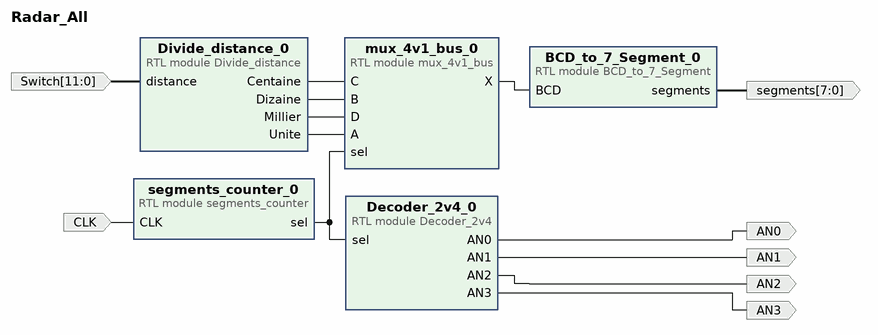
[diagram p0: block diagram of the top level]
# Vivado block design Radar_All, xc7a35ticpg236-1L, Vivado 2022.2
create_bd_design Radar_All

create_bd_port -dir I -from 11 -to 0 Switch
create_bd_port -dir I CLK
create_bd_port -dir O AN0
create_bd_port -dir O AN1
create_bd_port -dir O AN2
create_bd_port -dir O AN3
create_bd_port -dir O -from 7 -to 0 segments

create_bd_cell -type module -reference mux_4v1_bus mux_4v1_bus_0
create_bd_cell -type module -reference segments_counter segments_counter_0
create_bd_cell -type module -reference Decoder_2v4 Decoder_2v4_0
create_bd_cell -type module -reference BCD_to_7_Segment BCD_to_7_Segment_0
create_bd_cell -type module -reference Divide_distance Divide_distance_0

# ---- connections ----

connect_bd_net [get_bd_pins BCD_to_7_Segment_0/segments] [get_bd_ports segments]
connect_bd_net [get_bd_ports CLK] [get_bd_pins segments_counter_0/CLK]
connect_bd_net [get_bd_pins Decoder_2v4_0/AN0] [get_bd_ports AN0]
connect_bd_net [get_bd_pins Decoder_2v4_0/AN1] [get_bd_ports AN1]
connect_bd_net [get_bd_pins Decoder_2v4_0/AN2] [get_bd_ports AN2]
connect_bd_net [get_bd_pins Decoder_2v4_0/AN3] [get_bd_ports AN3]
connect_bd_net [get_bd_pins Divide_distance_0/Centaine] [get_bd_pins mux_4v1_bus_0/C]
connect_bd_net [get_bd_pins Divide_distance_0/Dizaine] [get_bd_pins mux_4v1_bus_0/B]
connect_bd_net [get_bd_pins Divide_distance_0/Millier] [get_bd_pins mux_4v1_bus_0/D]
connect_bd_net [get_bd_pins Divide_distance_0/Unite] [get_bd_pins mux_4v1_bus_0/A]
connect_bd_net [get_bd_ports Switch] [get_bd_pins Divide_distance_0/distance]
connect_bd_net [get_bd_pins mux_4v1_bus_0/X] [get_bd_pins BCD_to_7_Segment_0/BCD]
connect_bd_net [get_bd_pins segments_counter_0/sel] [get_bd_pins mux_4v1_bus_0/sel] [get_bd_pins Decoder_2v4_0/sel]

validate_bd_design
save_bd_design
